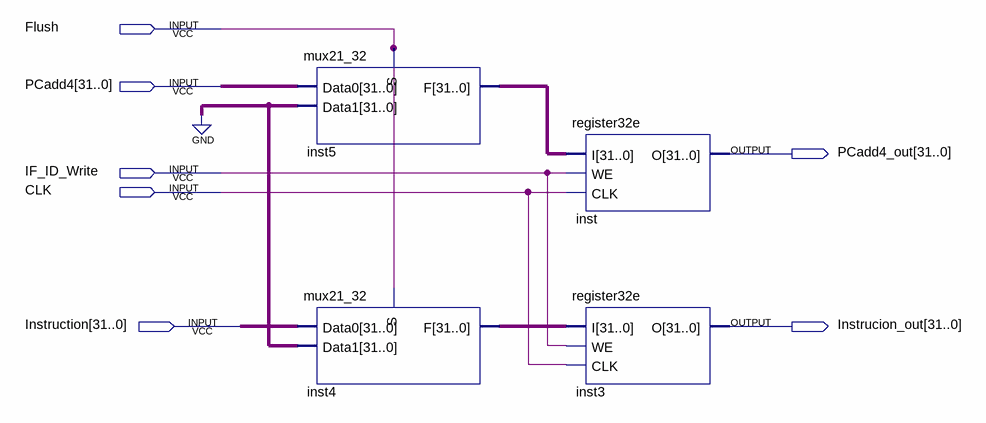
[diagram p0: schematic sheet]
// Quartus schematic IF_ID.bdf as structural Verilog: 4 symbols, 7 pins
module IF_ID (
  input  Flush,
  input  [31:0] PCadd4,
  input  IF_ID_Write,
  input  CLK,
  input  [31:0] Instruction,
  output [31:0] PCadd4_out,
  output [31:0] Instrucion_out
);

  wire [31:0] inst4_f, inst5_f;

  mux21_32 inst5 (.Data0(PCadd4), .Data1({32{1'b0}}), .S(Flush), .F(inst5_f));
  mux21_32 inst4 (.Data0(Instruction), .Data1({32{1'b0}}), .S(Flush), .F(inst4_f));
  register32e inst (.I(inst5_f), .WE(IF_ID_Write), .CLK(CLK), .O(PCadd4_out));
  register32e inst3 (.I(inst4_f), .WE(IF_ID_Write), .CLK(CLK), .O(Instrucion_out));
endmodule
